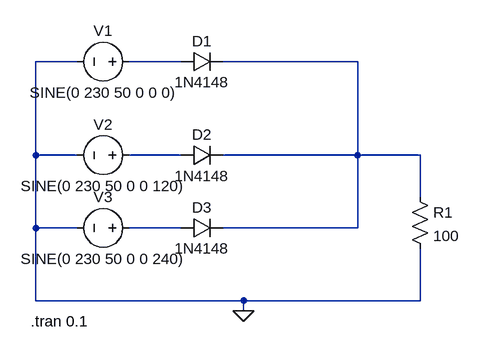
[diagram p0: schematic Lab2_14_02_2024_1_3PHR.asc]
Lab2_14_02_2024_1_3PHR.asc, the LTspice schematic file:
Version 4
SHEET 1 1056 680
WIRE -112 144 -176 144
WIRE 48 144 -32 144
WIRE 320 144 112 144
WIRE -176 288 -176 144
WIRE -112 288 -176 288
WIRE 48 288 -32 288
WIRE 320 288 320 144
WIRE 320 288 112 288
WIRE 416 288 320 288
WIRE 416 352 416 288
WIRE -176 400 -176 288
WIRE -112 400 -176 400
WIRE 48 400 -32 400
WIRE 320 400 320 288
WIRE 320 400 112 400
WIRE -176 512 -176 400
WIRE 144 512 -176 512
WIRE 416 512 416 432
WIRE 416 512 144 512
WIRE 144 528 144 512
FLAG 144 528 0
SYMBOL voltage -16 144 R90
WINDOW 0 -32 56 VBottom 2
WINDOW 3 32 56 VTop 2
WINDOW 123 0 0 Left 0
WINDOW 39 0 0 Left 0
SYMATTR InstName V1
SYMATTR Value SINE(0 230 50 0 0 0)
SYMBOL diode 48 160 R270
WINDOW 0 32 32 VTop 2
WINDOW 3 0 32 VBottom 2
SYMATTR InstName D1
SYMATTR Value 1N4148
SYMBOL res 400 336 R0
SYMATTR InstName R1
SYMATTR Value 100
SYMBOL voltage -16 288 R90
WINDOW 0 -32 56 VBottom 2
WINDOW 3 32 56 VTop 2
WINDOW 123 0 0 Left 0
WINDOW 39 0 0 Left 0
SYMATTR InstName V2
SYMATTR Value SINE(0 230 50 0 0 120)
SYMBOL voltage -16 400 R90
WINDOW 0 -32 56 VBottom 2
WINDOW 3 32 56 VTop 2
WINDOW 123 0 0 Left 0
WINDOW 39 0 0 Left 0
SYMATTR InstName V3
SYMATTR Value SINE(0 230 50 0 0 240)
SYMBOL diode 48 304 R270
WINDOW 0 32 32 VTop 2
WINDOW 3 0 32 VBottom 2
SYMATTR InstName D2
SYMATTR Value 1N4148
SYMBOL diode 48 416 R270
WINDOW 0 32 32 VTop 2
WINDOW 3 0 32 VBottom 2
SYMATTR InstName D3
SYMATTR Value 1N4148
TEXT -184 544 Left 2 !.tran 0.1

The netlist it stands for:
* Lab2_14_02_2024_1_3PHR.asc
V1 N001 0 SINE(0 230 50 0 0 0)
D1 N001 N002 1N4148
R1 N002 0 100
V2 N003 0 SINE(0 230 50 0 0 120)
V3 N004 0 SINE(0 230 50 0 0 240)
D2 N003 N002 1N4148
D3 N004 N002 1N4148
.model D D
.lib standard.dio
.tran 0.1
.backanno
.end